# EAGLE design sensor1 (EAGLE 6.4)
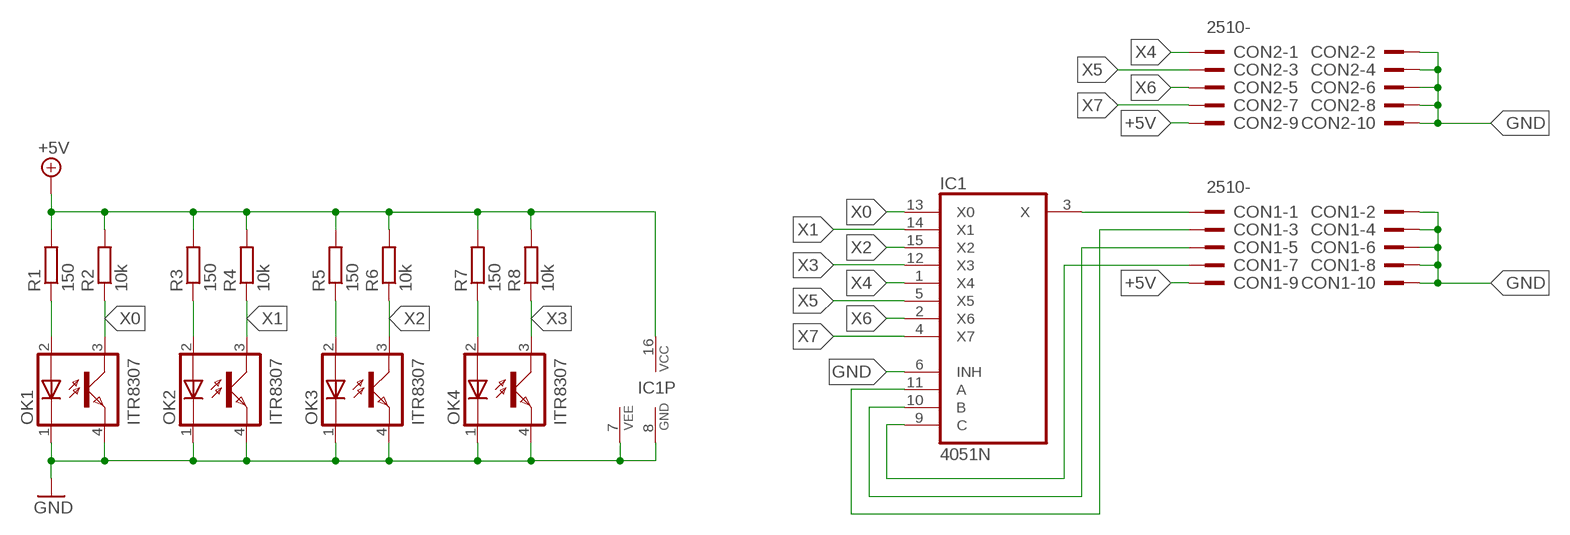
[diagram p0: schematic, sheet 1]

## Parts
CON1  2510-  [PAK100/2500-10]
CON2  2510-  [PAK100/2500-10]
IC1  4051N  [DIL16]
OK1  ITR8307  [F43]
OK2  ITR8307  [F43]
OK3  ITR8307  [F43]
OK4  ITR8307  [F43]
R1  150  R-EU_0204/7  [0204/7]
R2  10k  R-EU_0204/7  [0204/7]
R3  150  R-EU_0204/7  [0204/7]
R4  10k  R-EU_0204/7  [0204/7]
R5  150  R-EU_0204/7  [0204/7]
R6  10k  R-EU_0204/7  [0204/7]
R7  150  R-EU_0204/7  [0204/7]
R8  10k  R-EU_0204/7  [0204/7]

## Nets
+5V: CON1.9 CON2.9 IC1.16(VCC) R1.2 R2.2 R3.2 R4.2 R5.2 R6.2 R7.2 R8.2
DATA: CON1.1 IC1.3(X)
GND: CON1.2 CON1.4 CON1.6 CON1.8 CON1.10 CON2.2 CON2.4 CON2.6 CON2.8 CON2.10 IC1.6(INH) IC1.7(VEE) IC1.8(GND) OK1.1(C) OK1.4(EMIT) OK2.1(C) OK2.4(EMIT) OK3.1(C) OK3.4(EMIT) OK4.1(C) OK4.4(EMIT)
N$1: OK1.2(A) R1.1
N$4: OK2.2(A) R3.1
N$5: OK3.2(A) R5.1
N$6: OK4.2(A) R7.1
S0: CON1.3 IC1.11(A)
S1: CON1.5 IC1.10(B)
S2: CON1.7 IC1.9(C)
X0: IC1.13(X0) OK1.3(COL) R2.1
X1: IC1.14(X1) OK2.3(COL) R4.1
X2: IC1.15(X2) OK3.3(COL) R6.1
X3: IC1.12(X3) OK4.3(COL) R8.1
X4: CON2.1 IC1.1(X4)
X5: CON2.3 IC1.5(X5)
X6: CON2.5 IC1.2(X6)
X7: CON2.7 IC1.4(X7)

## Library data of the parts
CON1 CON2 = con-3m:2510-: 3M (TM) Pak 100 4-Wall Header Source: 3M; MF: 3M; MPN: 2510-6002UB; OC_FARNELL: 9838244; OC_NEWARK: 46F4725
IC1 = 40xx:4051: 8-channel ANALOG MULTIPLEXER
OK1-OK4 = everlight:ITR8307: SIEMENS OPTO COUPLER; OC_FARNELL: unknown; OC_NEWARK: unknown
R1-R8 = resistor:R-EU_: RESISTOR, European symbol

## Board
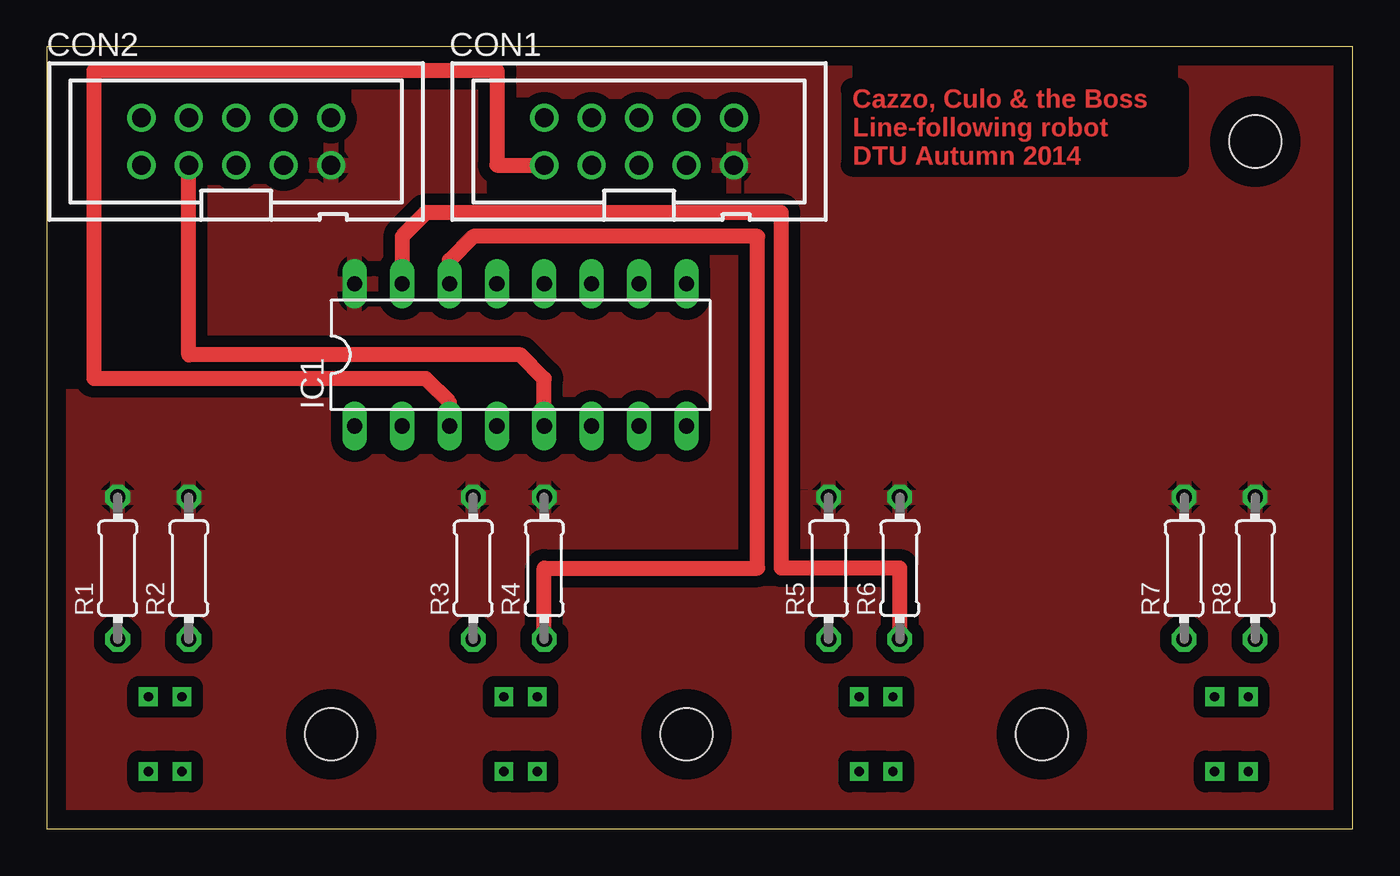
[diagram p1: board, top side]
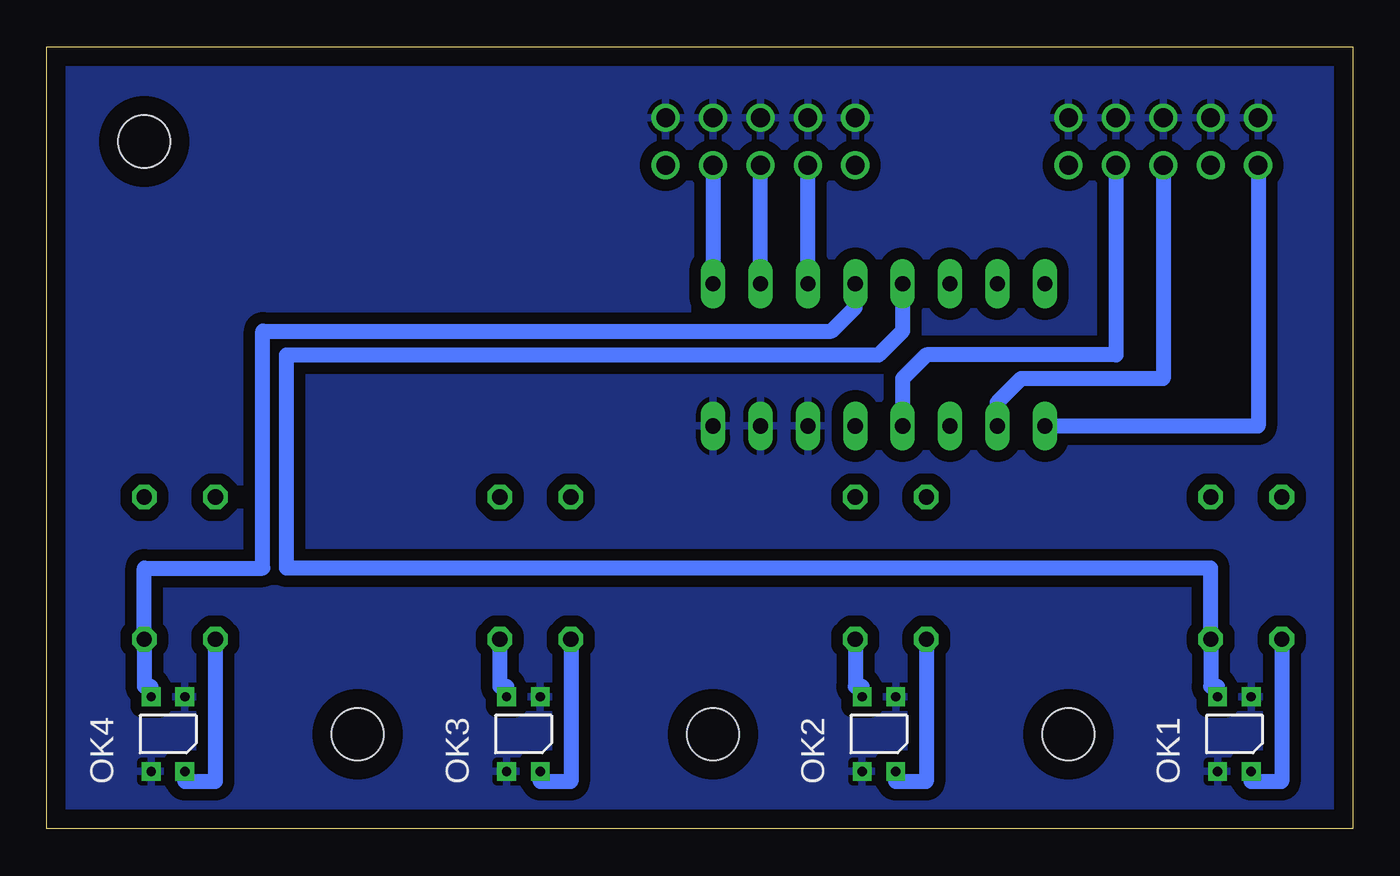
[diagram p2: board, bottom side, seen from below]

Size 70 x 41.91 mm. Coordinates in mm from the lower left corner, seen from the top.
Outline: 0,0 70,0 70,41.91 0,41.91 0,0
Copper layers (1*16): Top 0.035mm / dielectric 1.5mm / Bottom 0.035mm
Design rules "default": minimum track width 10mil, minimum drill 24mil, track to track 8mil, track to pad 8mil, pad to pad 8mil, via to via 8mil, smd to smd 8mil, copper to edge 40mil, drill to drill 8mil, minimum pad ring 10mil, minimum via ring 8mil, stop-mask expansion 4mil, vias tented up to drill 0mil, thermal gap 10mil
Holes 2.8 mm at 53.34,5.08 34.29,5.08 15.24,5.08 64.77,36.83

### Footprints (pad centres in the part's own frame; a part is rotated, then mirrored left to right if it is on the bottom)
PAK100/2500-10 = drill 1 pad 1.422: 1 -5.08,-1.27; 2 -5.08,1.27; 3 -2.54,-1.27; 4 -2.54,1.27; 5 0,-1.27; 6 0,1.27; 7 2.54,-1.27; 8 2.54,1.27; 9 5.08,-1.27; 10 5.08,1.27
DIL16 = drill 0.813 long: 1 -8.89,-3.81; 2 -6.35,-3.81; 3 -3.81,-3.81; 4 -1.27,-3.81; 5 1.27,-3.81; 6 3.81,-3.81; 7 6.35,-3.81; 8 8.89,-3.81; 9 8.89,3.81; 10 6.35,3.81; 11 3.81,3.81; 12 1.27,3.81; 13 -1.27,3.81; 14 -3.81,3.81; 15 -6.35,3.81; 16 -8.89,3.81
F43 = drill 0.5 square: 1 0.9,2; 2 0.9,-2; 3 -0.9,2; 4 -0.9,-2
0204/7 = drill 0.813 octagon: 1 -3.81,0; 2 3.81,0

### Placement (x,y rotation side)
CON1  31.75,36.83 0 top
CON2  10.16,36.83 0 top
IC1  25.4,25.4 0 top
OK1  6.35,5.08 0 bottom
OK2  25.4,5.08 0 bottom
OK3  44.45,5.08 0 bottom
OK4  63.5,5.08 0 bottom
R1  3.81,13.97 90 top
R2  7.62,13.97 90 top
R3  22.86,13.97 90 top
R4  26.67,13.97 90 top
R5  41.91,13.97 90 top
R6  45.72,13.97 90 top
R7  60.96,13.97 90 top
R8  64.77,13.97 90 top

### Tracks (layer width: path | path; a pad name or v marks a point on that pad's centre or on a via)
+5V
  pour Top (isolate 0.61): 0,41.91 0,0 69.85,0 69.85,41.91
DATA
  Top 0.813: IC1.3 21.59,22.86 20.32,24.13 2.54,24.13 2.54,40.64 24.13,40.64 24.13,35.56 CON1.1
GND
  pour Bottom (isolate 0.61): 0,0 0,41.91 69.85,41.91 69.85,0
N$1
  Bottom 0.813: R1.1 3.81,2.54 5.45,2.54 OK1.2
N$4
  Bottom 0.813: R3.1 22.86,2.54 24.5,2.54 OK2.2
N$5
  Bottom 0.813: R5.1 41.91,2.54 43.55,2.54 OK3.2
N$6
  Bottom 0.813: R7.1 60.96,2.54 62.6,2.54 OK4.2
S0
  Bottom 0.813: IC1.11 CON1.3
S1
  Bottom 0.813: IC1.10 CON1.5
S2
  Bottom 0.813: CON1.7 IC1.9
X0
  Bottom 0.406: 7.25,7.62 OK1.3
  Bottom 0.813: 7.25,7.62 7.62,7.62 R2.1 7.62,13.97 57.15,13.97 57.15,25.4 25.4,25.4 24.13,26.67 IC1.13
X1
  Top 0.813: R4.1 26.67,13.97 38.1,13.97 38.1,31.75 22.86,31.75 21.59,30.48 IC1.14
  Bottom 0.406: 26.3,7.62 OK2.3
  Bottom 0.813: R4.1 26.67,7.62 26.3,7.62
X2
  Top 0.813: R6.1 45.72,13.97 39.37,13.97 39.37,33.02 20.32,33.02 19.05,31.75 IC1.15
  Bottom 0.406: 45.72,7.62 45.35,7.62
  Bottom 0.813: R6.1 45.72,7.62 | 45.35,7.62 OK3.3
X3
  Bottom 0.406: 64.77,7.62 64.4,7.62
  Bottom 0.813: 64.77,7.62 R8.1 64.77,13.97 58.42,13.97 58.42,26.67 27.94,26.67 26.67,27.94 IC1.12 | 64.4,7.62 OK4.3
X4
  Bottom 0.813: CON2.1 5.08,21.59 IC1.1
X5
  Top 0.813: IC1.5 26.67,24.13 25.4,25.4 7.62,25.4 CON2.3
X6
  Bottom 0.813: CON2.5 10.16,24.13 17.78,24.13 19.05,22.86 IC1.2
X7
  Bottom 0.813: CON2.7 12.7,25.4 22.86,25.4 24.13,24.13 IC1.4

### Text on the board
Top: Cazzo, Culo & the Boss / Line-following robot / DTU Autumn 2014